# EAGLE design 01 (EAGLE 7.2.0)
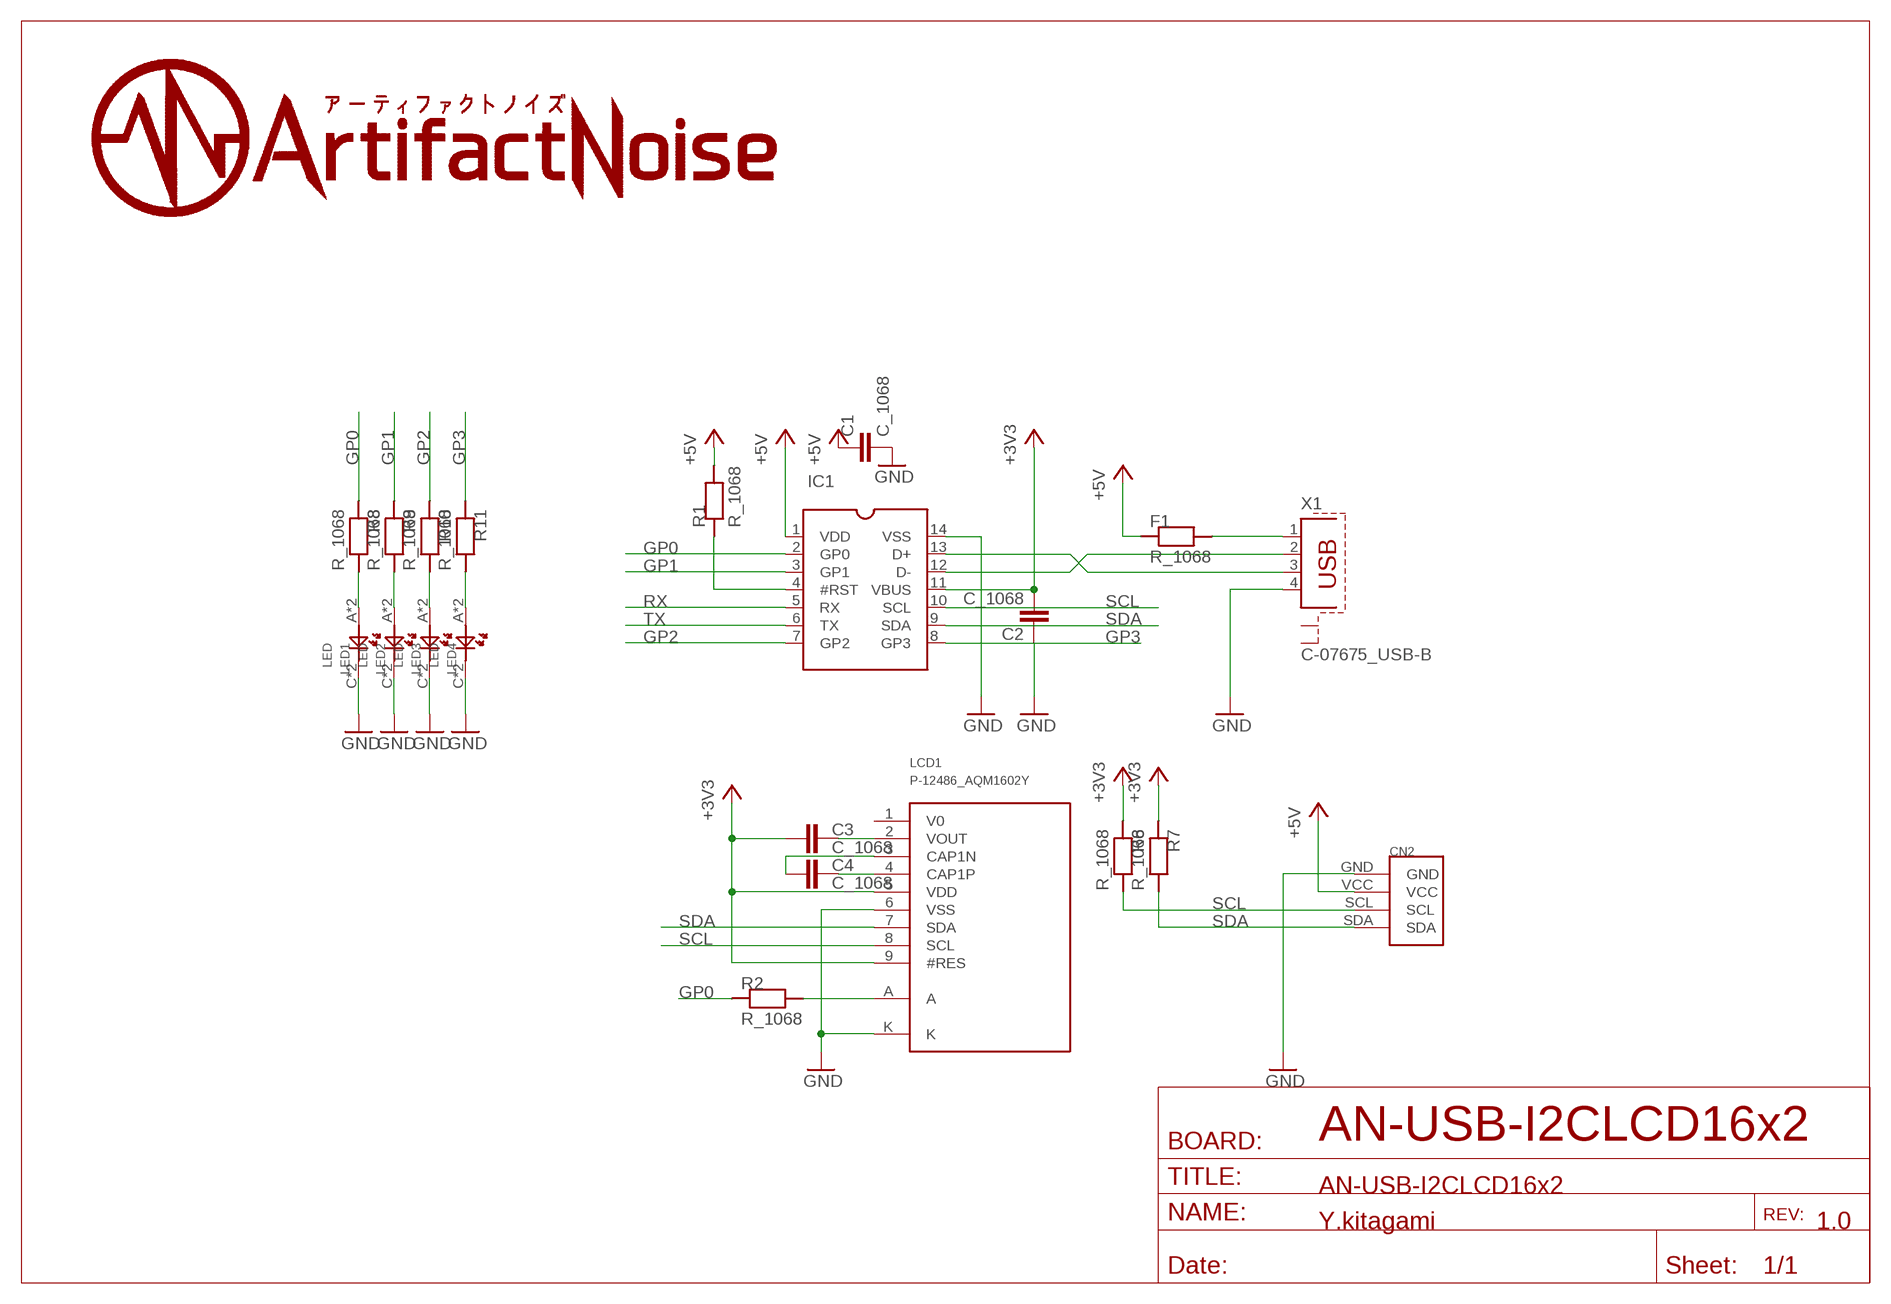
[diagram p0: schematic, sheet 1]

## Parts
C1  C_1068  [C0603]
C2  C_1068  [C0603]
C3  C_1068  [C0603]
C4  C_1068  [C0603]
CN2  PIN4  [PIN4]
F1  R_1068  [R0603]
IC1  _MCP2221A-I/PS  [SOCKET-14]
LCD1  P-12486_AQM1602Y  [AQM1602Y]
LED1  LED  [CHIPLED_0805]
LED2  LED  [CHIPLED_0805]
LED3  LED  [CHIPLED_0805]
LED4  LED  [CHIPLED_0805]
R1  R_1068  [R0603]
R2  R_1068  [R0603]
R6  R_1068  [R0603]
R7  R_1068  [R0603]
R8  R_1068  [R0603]
R9  R_1068  [R0603]
R10  R_1068  [R0603]
R11  R_1068  [R0603]
X1  C-07675_USB-B  [PN61729-S]

## Nets
+3V3: C2.2 C2.D2 C3.2 C3.D2 IC1.11(VBUS) LCD1.5(VDD) LCD1.9(#RES) R6.1 R6.D1 R7.1 R7.D1
+5V: C1.1 C1.D1 CN2.VCC F1.1 F1.D1 IC1.1(VDD) R1.2 R1.D2
GND: C1.2 C1.D2 C2.1 C2.D1 CN2.GND IC1.14(VSS) LCD1.6(VSS) LCD1.K LED1.C LED1.DC(C) LED2.C LED2.DC(C) LED3.C LED3.DC(C) LED4.C LED4.DC(C) X1.4
GP0: IC1.2(GP0) R2.1 R2.D1 R8.1 R8.D1
GP1: IC1.3(GP1) R9.1 R9.D1
GP2: IC1.7(GP2) R10.1 R10.D1
GP3: IC1.8(GP3) R11.1 R11.D1
N$1: IC1.4(#RST) R1.1 R1.D1
N$2: IC1.13(D+) X1.3
N$3: IC1.12(D-) X1.2
N$4: C4.1 C4.D1 LCD1.4(CAP1P)
N$5: F1.2 F1.D2 X1.1
N$6: C3.1 C3.D1 LCD1.2(VOUT)
N$7: LCD1.A R2.2 R2.D2
N$8: C4.2 C4.D2 LCD1.3(CAP1N)
N$9: LED1.A LED1.DA(A) R8.2 R8.D2
N$10: LED2.A LED2.DA(A) R9.2 R9.D2
N$11: LED3.A LED3.DA(A) R10.2 R10.D2
N$12: LED4.A LED4.DA(A) R11.2 R11.D2
RX: IC1.5(RX)
SCL: CN2.SCL IC1.10(SCL) LCD1.8(SCL) R6.2 R6.D2
SDA: CN2.SDA IC1.9(SDA) LCD1.7(SDA) R7.2 R7.D2
TX: IC1.6(TX)
Unconnected: LCD1.1(V0) X1.S1 X1.S2

## Notes on the sheet
- AN-USB-I2CLCD16x2
- AN-USB-I2CLCD16x2
- Y.kitagami | 1.0

## Library data of the parts
C1-C4 = 01:C_1068
CN2 = 01:PIN4
F1 R1 R2 R6-R11 = 01:R_1068
IC1 = 01:_MCP2221A-I/P: Dual In Line / Socket
LCD1 = 01:P-12486_AQM1602Y
LED1-LED4 = 01:LED
X1 = 01:C-07675_USB-B: BERG USB connector; OC_FARNELL: unknown; OC_NEWARK: unknown

## Board
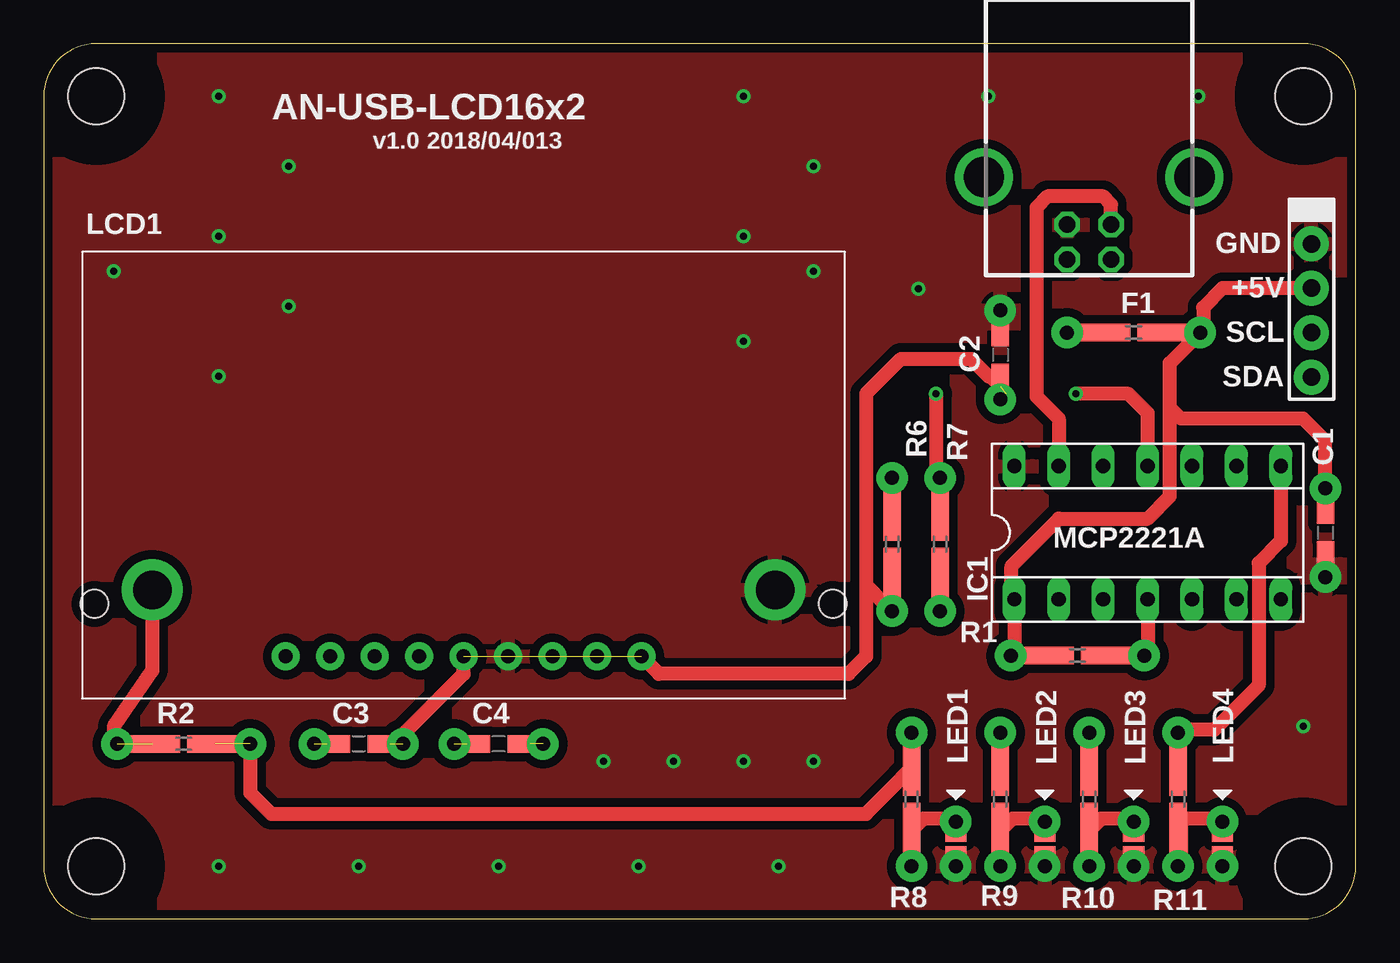
[diagram p1: board, top side]
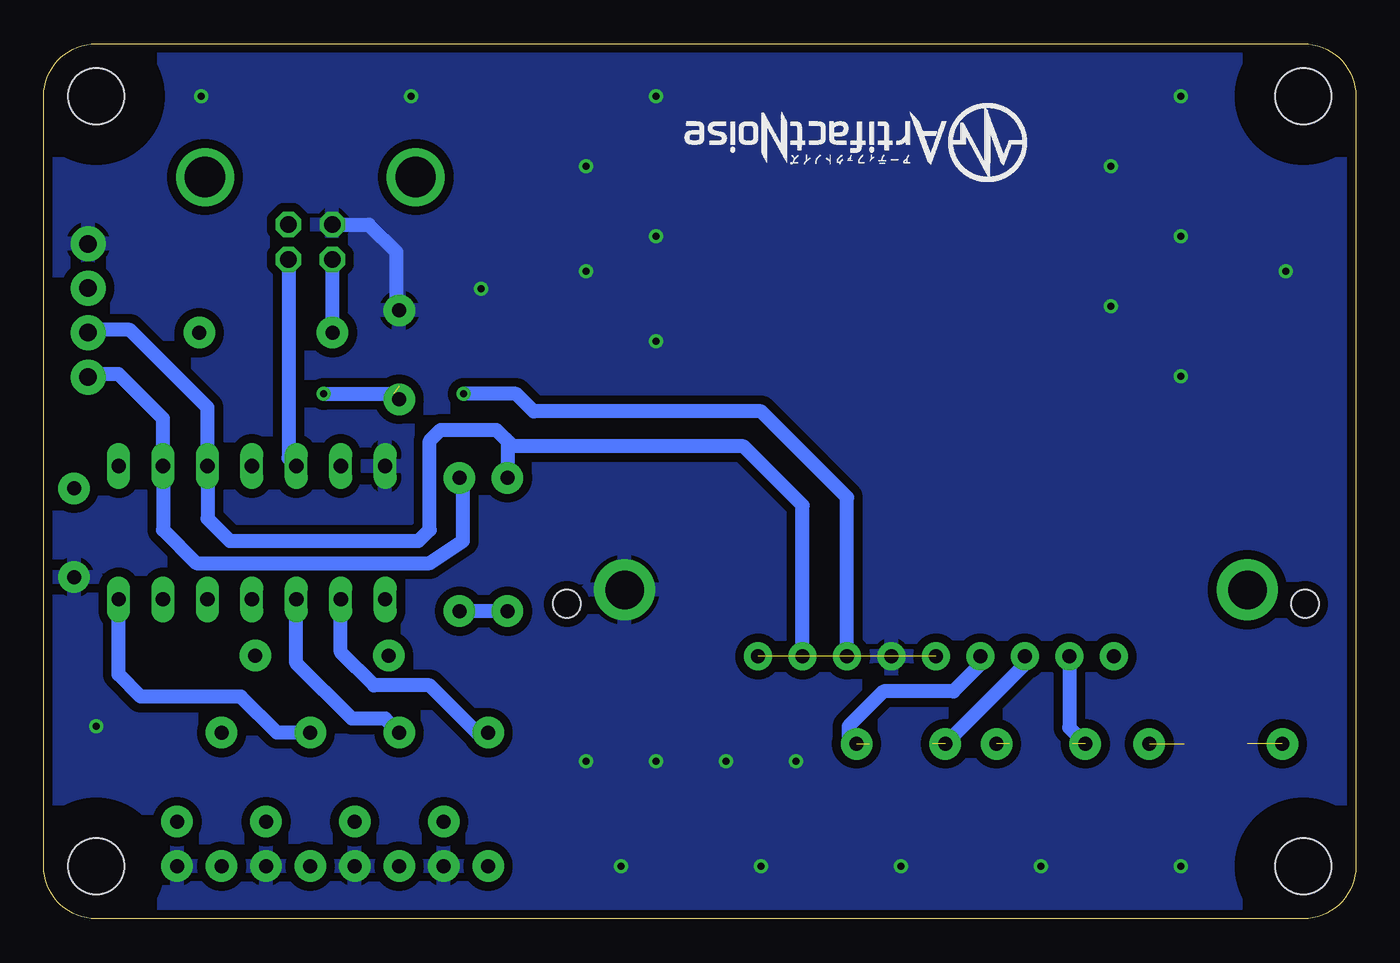
[diagram p2: board, bottom side, seen from below]

Size 75 x 50 mm. Coordinates in mm from the lower left corner, seen from the top.
Outline: 75,3 75,47 arc90 72,50 3,50 arc90 0,47 0,3 arc90 3,0 72,0 arc90 75,3
Copper layers (1*16): Top 0.035mm / dielectric 1.5mm / Bottom 0.035mm
Design rules "SeeedStudio_2layer_DRU_no_angle_20140221a": minimum track width 6mil, minimum drill 12mil, track to track 6mil, track to pad 6mil, pad to pad 6mil, via to via 6mil, smd to smd 0mil, copper to edge 10mil, drill to drill 10mil, minimum pad ring 10mil, minimum via ring 6mil, stop-mask expansion 2mil, vias tented up to drill 25mil, thermal gap 10mil
Holes 3.2 mm at 72,47 3,47 3,3 72,3
tRestrict: area -0.2,43.8 to 6.2,50.2; area -0.2,-0.2 to 6.2,6.2; area 68.8,-0.2 to 75.2,6.2; area 68.8,43.8 to 75.2,50.2
bRestrict: area -0.2,43.8 to 6.2,50.2; area -0.2,-0.2 to 6.2,6.2; area 68.8,-0.2 to 75.2,6.2; area 68.8,43.8 to 75.2,50.2

### Footprints (pad centres in the part's own frame; a part is rotated, then mirrored left to right if it is on the bottom)
C0603 = smd 2.6 x 1: 1 -1.8,0; 2 1.8,0 | drill 0.8 pad 1.8: D1 -2.54,0; D2 2.54,0
PIN4 = drill 1 pad 2: GND 0,-3.81; SCL 0,1.27; SDA 0,3.81; VCC 0,-1.27
R0603 = smd 3.2 x 1: 1 -1.8,0; 2 1.8,0 | drill 0.8 pad 1.8: D1 -3.81,0; D2 3.81,0
SOCKET-14 = drill 0.813 long: 1 -7.62,-3.81; 2 -5.08,-3.81; 3 -2.54,-3.81; 4 0,-3.81; 5 2.54,-3.81; 6 5.08,-3.81; 7 7.62,-3.81; 8 7.62,3.81; 9 5.08,3.81; 10 2.54,3.81; 11 0,3.81; 12 -2.54,3.81; 13 -5.08,3.81; 14 -7.62,3.81
AQM1602Y = drill 0.8 pad 1.6: 1 -10.16,0; 2 -7.62,0; 3 -5.08,0; 4 -2.54,0; 5 0,0; 6 2.54,0; 7 5.08,0; 8 7.62,0; 9 10.16,0 | drill 2.2 pad 3.5: A -17.8,3.8; K 17.8,3.8 | hole 1.6: -21.1,3; 21.1,3
CHIPLED_0805 = smd 1.2 x 0.8: A 0,-1.8; C 0,-0.74 | drill 0.8 pad 1.8: DA 0,-2.54; DC 0,0
PN61729-S = drill 0.95 octagon: 1 1.25,4.71; 2 -1.25,4.71; 3 -1.25,2.71; 4 1.25,2.71 | drill 2.3 pad 2.9: S1 -6.02,0; S2 6.02,0

### Placement (x,y rotation side)
C1  73.26,22.06 270 top
C2  54.68,32.22 270 top
C3  18,10 0 top
C4  26,10 180 top
CN2  72.46,34.76 180 top
F1  62.3,33.49 180 top
IC1  63.1,22.06 0 top
LCD1  24,15 0 top
LED1  52.14,3.01 180 top
LED2  57.22,3.01 180 top
LED3  62.3,3.01 180 top
LED4  67.38,3.01 180 top
R1  59.09,15.04 180 top
R2  8,10 180 top
R6  48.49,21.39 90 top
R7  51.23,21.39 90 top
R8  49.6,6.82 270 top
R9  54.68,6.82 270 top
R10  59.76,6.82 270 top
R11  64.84,6.82 270 top
U$1  [AN-LOGO2]  18.8,46.6 180 bottom
X1  59.76,42.38 180 top

### Tracks (layer width: path | path; a pad name or v marks a point on that pad's centre or on a via)
+3V3  (via drill 0.4 pad 0.8)  (3 unrouted)
  Top 0.8: IC1.11 63.1,28.9 62,30 v59,30 | 47,19.07 47,30 49,32 53,32 54,31 54.1,31 C2.2 | 47,19.07 48.04,18.04 | 48.04,18.04 R6.D1 | R6.1 48.49,18.5 48.04,18.04 | R7.1 R7.D1 | 47,19.07 47,15 46,14 35.16,14 LCD1.9 | C3.D2 20.54,10.54 24,14 LCD1.5
  Bottom 0.8: v59,30 55,30 C2.D2 | R6.D1 R7.D1
+5V
  Top 0.406: R1.2 R1.D2
  Top 0.8: F1.1 F1.D1 | CN2.VCC 67.38,36.03 66.28,34.92 66.28,33.66 F1.D1 | R1.D2 55.48,15.24 IC1.1 55.31,18.41 55.31,20.16 58.02,22.86 63.1,22.86 64.37,24.13 64.37,29.21 | C1.1 C1.D1 73.26,27.3 71.99,28.57 65,28.57 64.37,29.21 | 64.37,29.21 64.37,31.75 F1.D1
GND  (via drill 0.4 pad 0.8)
  Top 0.8: LED4.C LED4.DC
  Bottom 0.8: X1.4 56.41,39.67 54.84,38.1 54.84,34.92 C2.D1
  other vias: 50,36 10,3 18,3 26,3 34,3 42,3 32,9 36,9 40,9 44,9 4,37 44,37 66,47 54,47 40,47 44,43 14,43 10,47 10,39 40,39 40,33 14,35 10,31 72,11
  pour Top (isolate 0.5): 76.27,-0.8 -0.8,-0.8 -0.8,51.27 76.27,51.27
  pour Bottom (isolate 0.5): 76.27,-0.8 -0.8,-0.8 -0.8,51.27 76.27,51.27
GP0  (1 unrouted)
  Top 0.406: R8.1 R8.D1
  Top 0.8: R2.D1 11.81,7.19 13,6 47,6 49,8 49,8.02 R8.1
  Bottom 0.8: R8.D1 50.23,10.63 52.94,13.34 56.12,13.34 58.02,15.24 IC1.2
GP1
  Top 0.406: R9.1 R9.D1
  Bottom 0.8: R9.D1 55.48,11.43 57.38,11.43 60.56,14.61 IC1.3
GP2
  Top 0.406: R10.1 R10.D1
  Bottom 0.8: R10.D1 61.66,10.63 63.73,12.7 69.45,12.7 70.72,13.97 IC1.7
GP3
  Top 0.406: R11.1 R11.D1
  Top 0.8: IC1.8 70.72,21.59 69.45,20.32 69.45,13.34 66.91,10.79 65,10.79 R11.D1
N$1
  Top 0.406: R1.1 R1.D1
  Top 0.8: IC1.4 63.1,15.24 R1.D1
N$2
  Top 0.8: X1.3 61.01,40.83 60.56,41.27 57.38,41.27 56.75,40.64 56.75,29.84 58.02,28.57 IC1.13
N$3
  Bottom 0.8: X1.2 61.01,26.32 IC1.12
N$4  (1 unrouted)
  Bottom 0.8: C4.D1 29,10.46 29,11 27,13 23,13 21.46,14.54 LCD1.4
N$5
  Top 0.8: F1.D2 F1.2
  Bottom 0.8: X1.1 58.51,33.51 F1.D2
N$6  (1 unrouted)
  Bottom 0.8: LCD1.2 16.38,10.92 C3.D1
N$7  (1 unrouted)
  Top 0.8: LCD1.A 6.2,14.2 4,11 4,10.19 R2.D2
N$8  (1 unrouted)
  Bottom 0.8: LCD1.3 18.92,14.54 C4.D2
N$9
  Top 0.8: LED1.A LED1.DA 52.3,5.71 50.3,5.71 R8.2 R8.D2
N$10
  Top 0.8: LED2.A LED2.DA 57.38,5.71 55.38,5.71 R9.2 R9.D2
N$11
  Top 0.8: LED3.A LED3.DA 62.47,5.71 60.45,5.71 R10.2 59.76,3.98 59.92,3.17 R10.D2
N$12
  Top 0.8: LED4.A LED4.DA 67.55,5.71 65,5.71 65,4.86 | 65,4.86 65,3.17 R11.D2 | 65,4.86 R11.2
SCL
  Top 0.406: R6.2 R6.D2
  Bottom 0.8: 48.49,27.3 48.59,27.41 49.13,27.94 52.3,27.94 52.94,27.3 52.94,22.23 53.58,21.59 64.37,21.59 65.64,22.86 IC1.10 65.64,29.21 70.08,33.66 72.3,33.66 CN2.SCL | 48.49,27.3 R6.D2 | LCD1.8 31.62,23.62 35,27 48.19,27 48.49,27.3
SDA  (via drill 0.4 pad 0.8)
  Top 0.406: R7.2 R7.D2
  Top 0.8: v51,30 51,25.43 R7.D2
  Bottom 0.8: CN2.SDA 72.3,31.11 70.72,31.11 68.18,28.57 IC1.9 68.18,22.23 66.28,20.32 52.94,20.32 51.03,21.59 51.03,25 R7.D2 | LCD1.7 29.08,24.08 34,29 47,29 48,30 v51,30

### Text on the board
tPlace: AN-USB-LCD16x2 | v1.0 2018/04/013 | GND | +5V | SCL | SDA | MCP2221A